# Altium schematic sheet AdcetAlSys.SchDoc
size A0; SheetNumber: 1; SheetTotal: 1
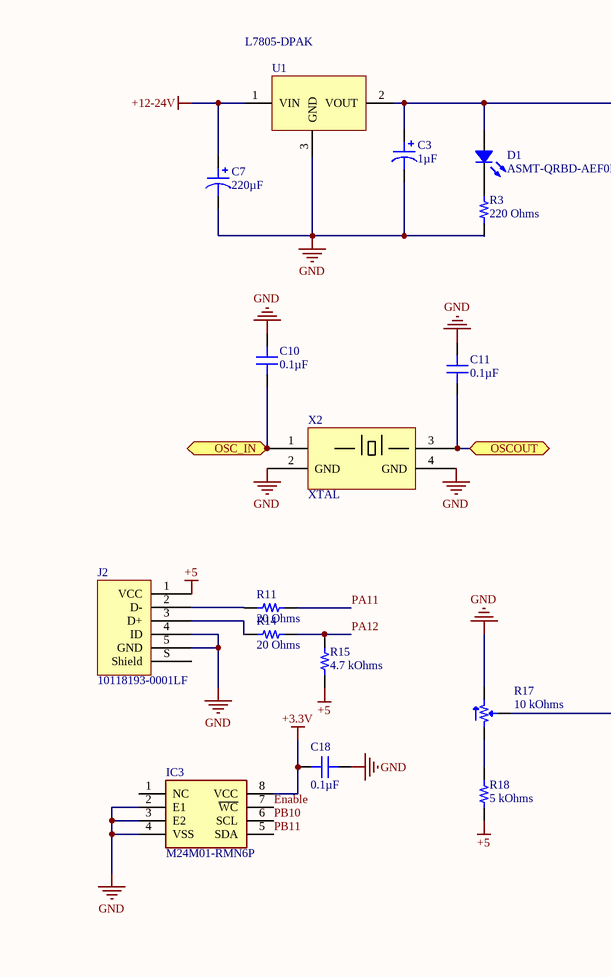
[diagram p0: AdcetAlSys.SchDoc, top left]
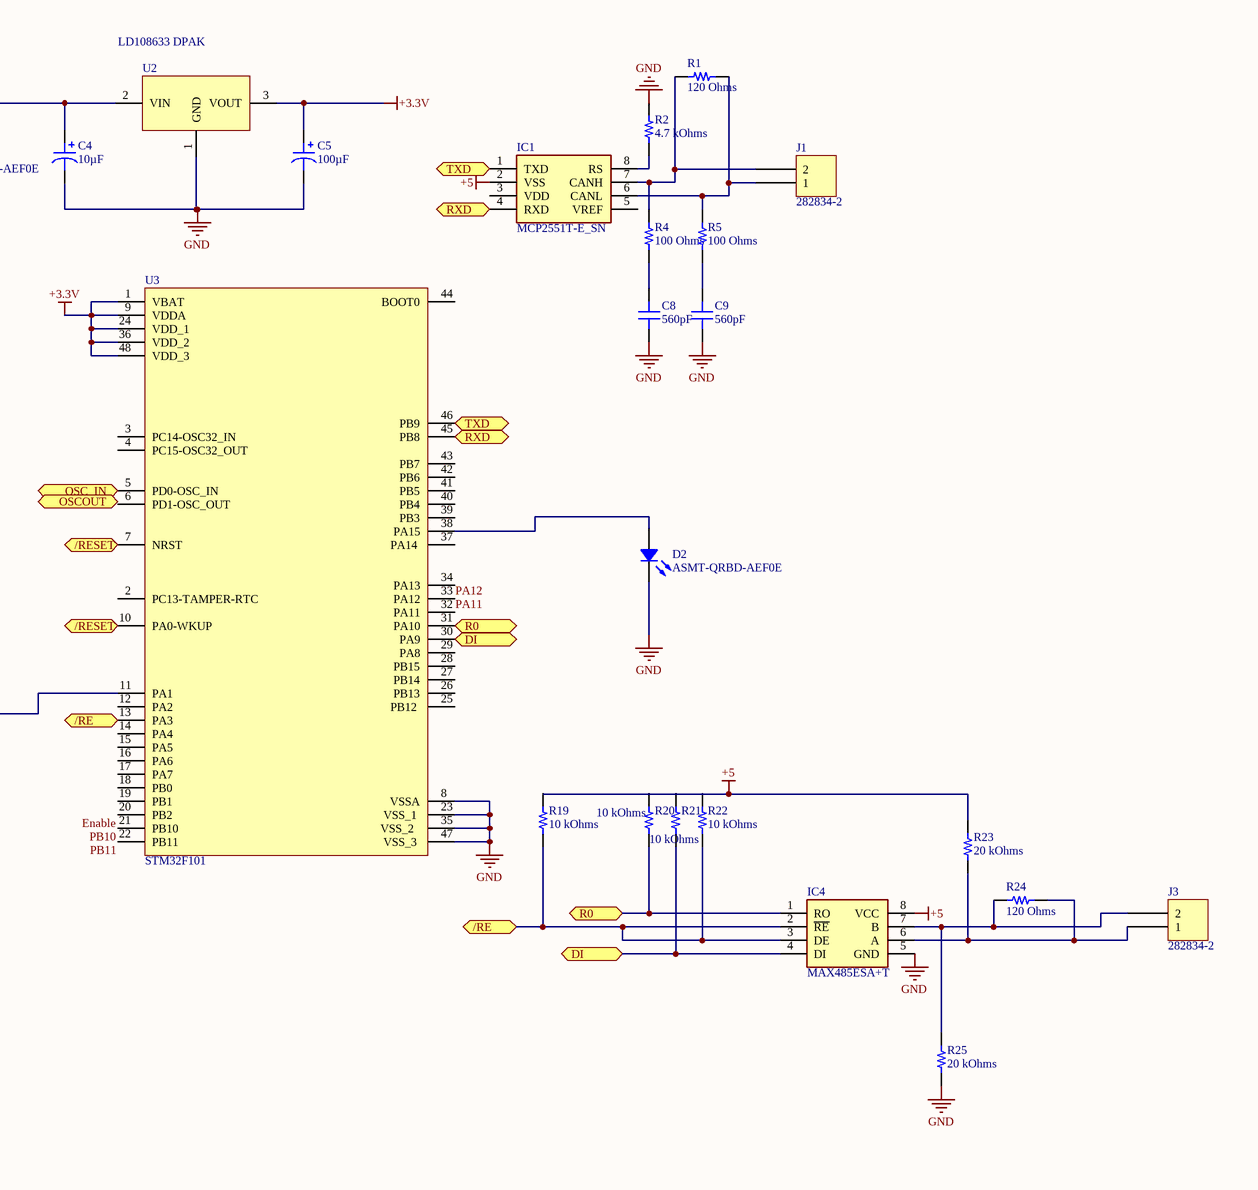
[diagram p1: AdcetAlSys.SchDoc, top right]
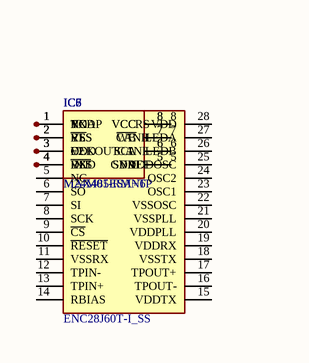
[diagram p2: AdcetAlSys.SchDoc, bottom left]

## Parts
C3  1µF  [CAP TH ALUM ELEC D4.00mm S1.50mm H8.00mm]
C4  10µF  [CAP TH ALUM ELEC D5.00mm S2.00mm H11.00mm]
C5  100µF  [CAP TH ALUM ELEC D6.30mm S2.50mm H11.20mm]
C7  220µF  [CAP TH ALUM ELEC D8.00mm S3.50mm H12.50mm]
C8  560pF  [CAP 0805_2012]
C9  560pF  [CAP 0805_2012]
C10  0.1µF  [CAP 0805_2012]
C11  0.1µF  [CAP 0805_2012]
C18  0.1µF  [CAP 0805_2012]
D1  ASMT-QRBD-AEF0E  [Broadcom 4-PLLC 3228]
D2  ASMT-QRBD-AEF0E  [Broadcom 4-PLLC 3228]
IC1  MCP2551T-E_SN  [SOIC127P600X175-8N]
IC3  M24M01-RMN6P  [SOIC127P600X175-8N]
IC4  MAX485ESA+T  [SOIC127P600X175-8N]
IC5  ENC28J60T-I_SS  [SOP65P780X200-28N]
IC6  MCP2551T-E_SN  [SOIC127P600X175-8N]
IC7  M24M01-RMN6P  [SOIC127P600X175-8N]
IC8  MAX485ESA+T  [SOIC127P600X175-8N]
J1  282834-2  [TE 282834-2]
J2  10118193-0001LF  [FCI USB 10118193-0001LF]
J3  282834-2  [TE 282834-2]
R1  120 Ohms  [RES 0805_2012]
R2  4.7 kOhms  [RES 0805_2012]
R3  220 Ohms  [RES 0805_2012]
R4  100 Ohms  [RES 0805_2012]
R5  100 Ohms  [RES 0805_2012]
R11  20 Ohms  [RES 0603_1608]
R14  20 Ohms  [RES 0603_1608]
R15  4.7 kOhms  [RES 0603_1608]
R17  10 kOhms  [POT BOURNS TRIMPOT TC33]
R18  5 kOhms  [RES 0805_2012]
R19  10 kOhms  [RES 0805_2012]
R20  10 kOhms  [RES 0805_2012]
R21  10 kOhms  [RES 0805_2012]
R22  10 kOhms  [RES 0805_2012]
R23  20 kOhms  [RES 0805_2012]
R24  120 Ohms  [RES 0805_2012]
R25  20 kOhms  [RES 0805_2012]
U1  L7805-DPAK  [DPAK228P972X230-3N]
U2  LD108633 DPAK  [DPAK228P972X230-3N]
U3  STM32F101  [LQFP48-STM]
X2  XTAL  [xtal]

## Ports
/RE (bidir), /RESET (bidir), DI (bidir), OSC_IN (bidir), OSCOUT (bidir), R0 (bidir), RXD (bidir), TXD (bidir)

## Nets
+3.3V: C5.1 C18.1 IC3.8(VCC) U2.3(VOUT) U3.1(VBAT) U3.9(VDDA) U3.24(VDD_1) U3.36(VDD_2) U3.48(VDD_3)
+5: IC1.2(VSS) IC4.8(VCC) J2.1(VCC) R15.1 R18.1 R23.2
+12-24V: C7.1 U1.1(VIN)
GND: C3.2 C4.2 C5.2 C7.2 C8.1 C9.1 C10.1 C11.1 C18.2 D2.2 IC3.2(E1) IC3.3(E2) IC3.4(VSS) IC4.5(GND) J2.4(ID) J2.5(GND) R3.1 R17.3 R25.1 U1.3(GND) U2.1(GND) U3.8(VSSA) U3.23(VSS_1) U3.35(VSS_2) U3.47(VSS_3) X2.2(GND) X2.4(GND)
/RE: IC4.2(~{RE}) IC4.3(DE) R19.1 R22.1 U3.13(PA3) ; port /RE
/RESET: U3.7(NRST) U3.10(PA0-WKUP) ; port /RESET
DI: IC4.4(DI) R21.1 U3.30(PA9) ; port DI
Enable: IC3.7(~{WC}) U3.20(PB2)
OSC_IN: C10.2 U3.5(PD0-OSC_IN) X2.1 ; port OSC_IN
OSCOUT: C11.2 X2.3 ; port OSCOUT
PA11: R11.2 U3.32(PA11)
PA12: R14.2 R15.2 U3.33(PA12)
PB10: IC3.6(SCL) U3.21(PB10)
PB11: IC3.5(SDA) U3.22(PB11)
R0: IC4.1(RO) R20.1 U3.31(PA10) ; port R0
RXD: IC1.4(RXD) U3.45(PB8) ; port RXD
TXD: IC1.1(TXD) U3.46(PB9) ; port TXD
NetC3_1: C3.1 C4.1 D1.1 U1.2(VOUT) U2.2(VIN)
NetC8_2: C8.2 R4.1
NetC9_2: C9.2 R5.1
NetD2_1: D2.1 U3.38(PA15)
NetIC1_6: IC1.6(CANL) J1.1 R1.2 R5.2
NetIC1_7: IC1.7(CANH) J1.2 R1.1 R4.2
NetIC1_8: IC1.8(RS) R2.1
NetIC4_6: IC4.6(A) J3.1 R23.1 R24.2
NetIC4_7: IC4.7(B) J3.2 R24.1 R25.2
NetIC5_1: IC5.1(VCAP) IC6.1(TXD) IC7.1(NC) IC8.1(RO)
NetIC5_2: IC5.2(VSS) IC6.2(VSS) IC7.2(E1) IC8.2(~{RE})
NetIC5_3: IC5.3(CLKOUT) IC6.3(VDD) IC7.3(E2) IC8.3(DE)
NetIC5_4: IC5.4(~{INT}) IC6.4(RXD) IC7.4(VSS) IC8.4(DI)
NetIC7_5: IC7.5(SDA) IC8.5(GND)
NetIC7_6: IC7.6(SCL) IC8.6(A)
NetIC7_7: IC7.7(~{WC}) IC8.7(B)
NetIC7_8: IC7.8(VCC) IC8.8(VCC)
NetJ2_2: J2.2(D-) R11.1
NetJ2_3: J2.3(D+) R14.1
NetR17_1: R17.1 R18.2
NetR17_2: R17.2 U3.11(PA1)

Not connected (* = marked no-connect by the designer): D1 2; IC1 3(VDD) 5(VREF); IC3 1(NC); IC5 5(NC) 6(SO) 7(SI) 8(SCK) 9(~{CS}) 10(~{RESET}) 11(VSSRX) 12(TPIN-) 13(TPIN+) 14(RBIAS) 15(VDDTX) 16(TPOUT-) 17(TPOUT+) 18(VSSTX) 19(VDDRX) 20(VDDPLL) 21(VSSPLL) 22(VSSOSC) 23(OSC1) 24(OSC2) 25(VDDOSC) 26(LEDB) 27(LEDA) 28(VDD); IC6 5(VREF) 6(CANL) 7(CANH) 8(RS); J2 S(Shield); R2 2; R3 2; R19 2; R20 2; R21 2; R22 2; U3 2(PC13-TAMPER-RTC) 3(PC14-OSC32_IN) 4(PC15-OSC32_OUT) 6(PD1-OSC_OUT) 12(PA2) 14(PA4) 15(PA5) 16(PA6) 17(PA7) 18(PB0) 19(PB1) 25(PB12_) 26(PB13) 27(PB14) 28(PB15) 29(PA8) 34(PA13) 37(PA14_) 39(PB3) 40(PB4) 41(PB5) 42(PB6) 43(PB7) 44(BOOT0)

## Notes on the sheet
- Labels drawn without touching a wire or pin: GND

## Library data of the parts
C3 = USR1H010MDD: CAP ALUM 1UF 20% 50V RADIAL; Manufacturer: Nichicon; Lifetime @ Temp.: 2000 Hrs @ 85°C; Polarization: Polar; Ripple Current @ High Frequency: 15mA @ 10kHz; Ripple Current @ Low Frequency: 10mA @ 120Hz; Part Number: USR1H010MDD; Applications: General Purpose; Capacitance: 1µF; ComponentLink1Description: Datasheet; ComponentLink1URL: http://nichicon-us.com/english/products/pdfs/e-usa_usr.pdf; ComponentLink2Description: DigiKey Link; ComponentLink2URL: http://digikey.com/product-detail/en/nichicon/USR1H010MDD/493-6031-ND/2539217; Device Package: Radial, Can; Height - Seated (Max): 0.315" (8.00mm); LastUpdated: 6.09.2020 01:48:38; Lead Spacing: 0.059" (1.50mm); Lifecycle Status: Active; Minimum Order: 1; Mounting Type: Through Hole; Operating Temperature: -40°C ~ 85°C; Package / Case: Radial, Can; Packaging: Bulk; PartId: 23369; Part Status: Active; Price: 0.23; Series: USR; Size / Dimension: 0.157" Dia (4.00mm); Supplier 1: DigiKey; Supplier Part Number 1: 493-6031-ND; Tolerance: ±20%; Value: 1µF; Voltage - Rated: 50V
C4 = RFS-16V100ME3#5: CAP ALUM 10UF 20% 16V RADIAL; Manufacturer: Elna America; Lifetime @ Temp.: 1000 Hrs @ 85°C; Polarization: Polar; Ripple Current @ Low Frequency: 35mA @ 120Hz; Part Number: RFS-16V100ME3#5; Applications: Audio; Capacitance: 10µF; ComponentLink1Description: Datasheet; ComponentLink1URL: http://www.elna.co.jp/en/capacitor/alumi/catalog/pdf/rfs_e.pdf; ComponentLink2Description: DigiKey Link; ComponentLink2URL: http://digikey.com/product-detail/en/elna-america/RFS-16V100ME3-5/604-1109-ND/2171160; Device Package: Radial, Can; Height - Seated (Max): 0.433" (11.00mm); LastUpdated: 4.09.2020 23:28:56; Lead Spacing: 0.079" (2.00mm); Lifecycle Status: Active; Minimum Order: 1; Mounting Type: Through Hole; Operating Temperature: -40°C ~ 85°C; Package / Case: Radial, Can; Packaging: Bulk; PartId: 21468; Part Status: Active; Price: 0.30; Series: RFS, SILMIC II; Size / Dimension: 0.197" Dia (5.00mm); Supplier 1: DigiKey; Supplier Part Number 1: 604-1109-ND; Tolerance: ±20%; Value: 10µF; Voltage - Rated: 16V
C5 = ECE-A0JN101U: CAP ALUM 100UF 20% 6.3V RADIAL; Manufacturer: Panasonic Electronic Components; Lifetime @ Temp.: 2000 Hrs @ 85°C; Polarization: Bi-Polar; Ripple Current @ High Frequency: 221mA @ 10kHz; Part Number: ECE-A0JN101U; Applications: General Purpose; Capacitance: 100µF; ComponentLink2Description: DigiKey Link; ComponentLink2URL: http://digikey.com/product-detail/en/panasonic-electronic-components/ECE-A0JN101U/P1143-ND/227584; Device Package: Radial, Can; Height - Seated (Max): 0.441" (11.20mm); LastUpdated: 4.09.2020 01:05:43; Lead Spacing: 0.098" (2.50mm); Lifecycle Status: Active; Minimum Order: 1; Mounting Type: Through Hole; Operating Temperature: -40°C ~ 85°C; Package / Case: Radial, Can; Packaging: Bulk; PartId: 19981; Part Status: Active; Price: 0.45; Series: SU; Size / Dimension: 0.248" Dia (6.30mm); Supplier 1: DigiKey; Supplier Part Number 1: P1143-ND; Tolerance: ±20%; Value: 100µF; Voltage - Rated: 6.3V
C7 = ECA-1VM221BJ: CAP ALUM 220UF 20% 35V RADIAL; Manufacturer: Panasonic Electronic Components; Lifetime @ Temp.: 2000 Hrs @ 85°C; Polarization: Polar; Ripple Current @ High Frequency: 595mA @ 10kHz; Ripple Current @ Low Frequency: 350mA @ 120Hz; Part Number: ECA-1VM221BJ; Applications: General Purpose; Capacitance: 220µF; ComponentLink1Description: Datasheet; ComponentLink1URL: //media.digikey.com/pdf/Data%20Sheets/Panasonic%20Electronic%20Components/ECA-xxM%20Series,TypeA.pdf; ComponentLink2Description: DigiKey Link; ComponentLink2URL: http://digikey.com/product-detail/en/panasonic-electronic-components/ECA-1VM221BJ/P10419TB-ND/268504; Device Package: Radial, Can; Height - Seated (Max): 0.492" (12.50mm); LastUpdated: 7.09.2020 05:24:51; Lead Spacing: 0.138" (3.50mm); Lifecycle Status: Active; Minimum Order: 1000; Mounting Type: Through Hole; Operating Temperature: -40°C ~ 85°C; Package / Case: Radial, Can; Packaging: TapeAndBox; PartId: 7241; Part Status: Active; Price: 0.08; Series: M; Size / Dimension: 0.315" Dia (8.00mm); Supplier 1: DigiKey; Supplier Part Number 1: P10419TB-ND; Tolerance: ±20%; Value: 220µF; Voltage - Rated: 35V
C8 C9 = 08055A561FAT2A: CAP CER 560PF 50V C0G/NP0 0805; Manufacturer: AVX Corporation; Temperature Coefficient: C0G, NP0; Tolerance: ±1%; Part Number: 08055A561FAT2A; Value: 560pF; Applications: General Purpose; Capacitance: 560pF; ComponentLink1Description: Datasheet; ComponentLink1URL: http://datasheets.avx.com/C0GNP0-Dielectric.pdf; ComponentLink2Description: DigiKey Link; ComponentLink2URL: http://digikey.com/product-detail/en/avx-corporation/08055A561FAT2A/478-6047-1-ND/2208961; Device Package: 0805 (2012 Metric); LastUpdated: 2.09.2020 01:04:40; Lifecycle Status: Active; Minimum Order: 1; Mounting Type: Surface Mount, MLCC; Operating Temperature: -55°C ~ 125°C; Package / Case: 0805 (2012 Metric); Packaging: TapeAndReel; PartId: 3349; Part Status: Active; Price: 0.15; Series: -; Size / Dimension: 0.079" L x 0.049" W (2.01mm x 1.25mm); Supplier 1: DigiKey; Supplier Part Number 1: 478-6047-1-ND; Thickness (Max): 0.037" (0.94mm); Voltage - Rated: 50V
C10 C11 C18 = 0805Y0250104KXT: CAP CER 0.1UF 25V X7R 0805; Manufacturer: Knowles Syfer; Tolerance: ±10%; Part Number: 0805Y0250104KXT; Value: 0.1µF; Applications: Boardflex Sensitive; Capacitance: 0.1µF; ComponentLink1Description: Datasheet; ComponentLink1URL: https://www.knowlescapacitors.com/getattachment/2dbfc8bc-e2b3-4b4d-afb1-43b011b9ebe0/High-Std-Voltage.aspx; ComponentLink2Description: DigiKey Link; ComponentLink2URL: http://digikey.com/product-detail/en/knowles-syfer/0805Y0250104KXT/1608-1010-1-ND/5730209; Device Package: 0805 (2012 Metric); Features: Soft Termination; LastUpdated: 2.09.2020 01:04:40; Lifecycle Status: Active; Minimum Order: 1; Mounting Type: Surface Mount, MLCC; Operating Temperature: -55°C ~ 125°C; Package / Case: 0805 (2012 Metric); Packaging: TapeAndReel; PartId: 3471; Part Status: Active; Price: 0.16; Series: FlexiCap™; Size / Dimension: 0.079" L x 0.049" W (2.00mm x 1.25mm); Supplier 1: DigiKey; Supplier Part Number 1: 1608-1010-1-ND; Temperature Coefficient: X7R; Thickness (Max): 0.051" (1.30mm); Voltage - Rated: 25V
D1 D2 = ASMT-QRBD-AEF0E: LED INDICATOR 0.5W RED 4PLCC; Manufacturer: Broadcom Limited; Current - Max: 300mA; Current - Test: 150mA; Flux @ Current/Temperature - Test: 16lm (12lm ~ 20lm); Lumens/Watt @ Current - Test: 43 lm/W; Temperature - Test: 25°C; Viewing Angle: 120°; Voltage - Forward (Vf) (Typ): 2.5V; Wavelength: 628nm (620nm ~ 635nm); Part Number: ASMT-QRBD-AEF0E; Color: Red; ComponentLink1Description: Datasheet; ComponentLink1URL: https://docs.broadcom.com/docs/AV02-1841EN; ComponentLink2Description: DigiKey Link; ComponentLink2URL: http://digikey.com/product-detail/en/broadcom-limited/ASMT-QRBD-AEF0E/516-2679-1-ND/3909187; Device Package: 4-PLCC; Height - Seated (Max): 0.083" (2.10mm); LastUpdated: 24.04.2020 00:57:49; Lifecycle Status: Active; Minimum Order: 1; Mounting Type: Surface Mount; Package / Case: 4-PLCC; Packaging: TapeAndReel; Part Status: Active; Price: 0.42; Size / Dimension: 0.126" L x 0.110" W (3.20mm x 2.80mm); Supplier 1: DigiKey; Supplier Part Number 1: 516-2679-1-ND; Supplier Device Package: 4-PLCC
IC1 IC6 = MCP2551T-E_SN: Integrated Circuit; Manufacturer_Name: Microchip; Manufacturer_Part_Number: MCP2551T-E/SN; Datasheet Link: https://componentsearchengine.com/Datasheets/1/MCP2551T-E_SN.pdf; Height: 1.75mm; Mouser Part Number: 579-MCP2551T-E/SN; Mouser Price/Stock: https://www.mouser.co.uk/ProductDetail/Microchip-Technology/MCP2551T-E-SN?qs=gZwDaUDMhIcQtLtB%252B7bOWQ%3D%3D; Arrow Part Number: MCP2551T-E/SN; Arrow Price/Stock: https://www.arrow.com/en/products/mcp2551t-esn/microchip-technology?region=nac
IC3 IC7 = M24M01-RMN6P: Integrated Circuit; Manufacturer_Name: STMicroelectronics; Datasheet Link: https://datasheet.datasheetarchive.com/originals/distributors/SFDatasheet-5/sf-000111818.pdf; Height: 1.75mm; Manufacturer_Part_Number: M24M01-RMN6P; Mouser Part Number: 511-M24M01-RMN6P; Mouser Price/Stock: https://www.mouser.co.uk/ProductDetail/STMicroelectronics/M24M01-RMN6P?qs=Djavi1aLnwpufYbzjHXCEA%3D%3D; Arrow Part Number: M24M01-RMN6P; Arrow Price/Stock: https://www.arrow.com/en/products/m24m01-rmn6p/stmicroelectronics?region=nac
IC4 IC8 = MAX485ESA+T: Integrated Circuit; Manufacturer_Name: Maxim Integrated; Datasheet Link: https://datasheets.maximintegrated.com/en/ds/MAX1487-MAX491.pdf; Height: 1.75mm; Manufacturer_Part_Number: MAX485ESA+T; Mouser Part Number: 700-MAX485ESAT; Mouser Price/Stock: https://www.mouser.co.uk/ProductDetail/Maxim-Integrated/MAX485ESA%2bT?qs=LHmEVA8xxfYXmvxEk%252BFtEg%3D%3D; Arrow Part Number: MAX485ESA+T; Arrow Price/Stock: https://www.arrow.com/en/products/max485esat/maxim-integrated?region=nac
IC5 = ENC28J60T-I_SS: Integrated Circuit; Manufacturer_Name: Microchip; Manufacturer_Part_Number: ENC28J60T-I/SS; Datasheet Link: https://mouser.componentsearchengine.com/Datasheets/2/ENC28J60T-I_SS.pdf; Height: 2mm; Mouser Part Number: 579-ENC28J60T-I/SS; Mouser Price/Stock: https://www.mouser.co.uk/ProductDetail/Microchip-Technology/ENC28J60T-I-SS?qs=0swJU7D5CoWRYqX2omYpJQ%3D%3D; Arrow Part Number: ENC28J60T-I/SS; Arrow Price/Stock: https://www.arrow.com/en/products/enc28j60t-iss/microchip-technology?region=nac
J1 J3 = 282834-2: TERM BLK 2P SIDE ENT 2.54MM PCB; Manufacturer: TE Connectivity AMP Connectors; Current: 10A; Mating Orientation: Horizontal with Board; Number of Levels: 1; Pitch: 0.100" (2.54mm); Positions Per Level: 2; Voltage: 150V; Wire Gauge: 16-30 AWG; Wire Termination: Screw - Rising Cage Clamp; Part Number: 282834-2; Color: Green; ComponentLink1Description: Datasheet; ComponentLink1URL: https://www.te.com/commerce/DocumentDelivery/DDEController?Action=srchrtrv&DocNm=282834&DocType=Customer+Drawing&DocLang=English; ComponentLink2Description: DigiKey Link; ComponentLink2URL: http://digikey.com/product-detail/en/te-connectivity-amp-connectors/282834-2/A98333-ND/1150135; LastUpdated: 15.01.2020 04:15:38; Lifecycle Status: Active; Minimum Order: 1; Mounting Type: Through Hole; Packaging: Bulk; Part Status: Active; Price: 0.88; Series: Buchanan; Supplier 1: DigiKey; Supplier Part Number 1: A98333-ND
J2 = 10118193-0001LF: CONN RCPT USB2.0 MICRO B SMD R/A; Manufacturer: Amphenol ICC (FCI); Connector Type: USB - micro B; Current Rating (Amps): 1.8A per Contact; Gender: Receptacle; Mating Cycles: 10000; Number of Contacts: 5; Number of Ports: 1; Shielding: Shielded; Voltage - Rated: 100VAC; Part Number: 10118193-0001LF; ComponentLink1Description: Datasheet; ComponentLink1URL: https://cdn.amphenol-icc.com/media/wysiwyg/files/documentation/datasheet/inputoutput/io_usb_micro.pdf; ComponentLink2Description: DigiKey Link; ComponentLink2URL: //digikey.com/product-detail/en/amphenol-icc-fci/10118193-0001LF/609-4616-2-ND/2785388; Features: Solder Retention; LastUpdated: 9.12.2019 20:51:28; Lifecycle Status: 0; Minimum Order: 1; Mounting Feature: Horizontal; Mounting Type: Surface Mount, Right Angle; Through Hole; Operating Temperature: -30°C ~ 80°C; Packaging: TapeAndReel; Part Status: Active; Price: 0.21; Series: -; Specifications: USB 2.0; Supplier 1: DigiKey; Supplier Part Number 1: 609-4616-2-ND; Termination: Solder
R1 R24 = CRGP0805F120R: CRGP 0805 120R 1%; Manufacturer: TE Connectivity Passive Product; Power (Watts): 0.333W, 1/3W; Temperature Coefficient: ±100ppm/°C; Part Number: CRGP0805F120R; Value: 120 Ohms; ComponentLink1Description: Datasheet; ComponentLink1URL: https://www.te.com/commerce/DocumentDelivery/DDEController?Action=srchrtrv&DocNm=9-1773463-9&DocType=DS&DocLang=English; ComponentLink2Description: DigiKey Link; ComponentLink2URL: http://digikey.com/product-detail/en/te-connectivity-passive-product/CRGP0805F120R/A130466CT-ND/8578298; Composition: Thick Film; Device Package: 0805 (2012 Metric); Features: Pulse Withstanding; Height - Seated (Max): 0.026" (0.65mm); LastUpdated: 2.09.2020 01:14:53; Lifecycle Status: Active; Minimum Order: 1; Number of Terminations: 2; Operating Temperature: -55°C ~ 155°C; Package / Case: 0805 (2012 Metric); Packaging: TapeAndReel; PartId: 41696; Part Status: Active; Price: 0.02; Resistance: 120 Ohms; Series: CRGP; Size / Dimension: 0.079" L x 0.049" W (2.00mm x 1.25mm); Supplier 1: DigiKey; Supplier Part Number 1: A130466CT-ND; Supplier Device Package: 0805; Tolerance: ±1%
R2 = RR1220P-472-D: RES SMD 4.7K OHM 0.5% 1/10W 0805; Manufacturer: Susumu; Power (Watts): 0.1W, 1/10W; Temperature Coefficient: ±25ppm/°C; Part Number: RR1220P-472-D; Value: 4.7 kOhms; ComponentLink1Description: Datasheet; ComponentLink1URL: http://www.susumu.co.jp/common/pdf/n_catalog_partition05_en.pdf; ComponentLink2Description: DigiKey Link; ComponentLink2URL: http://digikey.com/product-detail/en/susumu/RR1220P-472-D/RR12P4.7KDCT-ND/432846; Composition: Thin Film; Device Package: 0805 (2012 Metric); Height - Seated (Max): 0.020" (0.50mm); LastUpdated: 2.09.2020 01:14:59; Lifecycle Status: Active; Minimum Order: 1; Number of Terminations: 2; Operating Temperature: -55°C ~ 125°C; Package / Case: 0805 (2012 Metric); Packaging: TapeAndReel; PartId: 39098; Part Status: Active; Price: 0.01; Resistance: 4.7 kOhms; Series: RR; Size / Dimension: 0.079" L x 0.049" W (2.00mm x 1.25mm); Supplier 1: DigiKey; Supplier Part Number 1: RR12P4.7KDCT-ND; Tolerance: ±0.5%
R3 = ERJ-6ENF2200V: RES SMD 220 OHM 1% 1/8W 0805; Manufacturer: Panasonic Electronic Components; Power (Watts): 0.125W, 1/8W; Temperature Coefficient: ±100ppm/°C; Part Number: ERJ-6ENF2200V; Value: 220 Ohms; ComponentLink1Description: Datasheet; ComponentLink1URL: https://industrial.panasonic.com/cdbs/www-data/pdf/RDA0000/AOA0000C304.pdf; ComponentLink2Description: DigiKey Link; ComponentLink2URL: http://digikey.com/product-detail/en/panasonic-electronic-components/ERJ-6ENF2200V/P220CCT-ND/1746831; Composition: Thick Film; Device Package: 0805 (2012 Metric); Features: Automotive AEC-Q200; Height - Seated (Max): 0.028" (0.70mm); LastUpdated: 2.09.2020 01:15:19; Lifecycle Status: Active; Minimum Order: 1; Number of Terminations: 2; Operating Temperature: -55°C ~ 155°C; Package / Case: 0805 (2012 Metric); Packaging: TapeAndReel; PartId: 30101; Part Status: Active; Price: 0.01; Ratings: AEC-Q200; Resistance: 220 Ohms; Series: ERJ; Size / Dimension: 0.079" L x 0.049" W (2.00mm x 1.25mm); Supplier 1: DigiKey; Supplier Part Number 1: P220CCT-ND; Supplier Device Package: 0805; Tolerance: ±1%
R4 R5 = RR1220P-101-D: RES SMD 100 OHM 0.5% 1/10W 0805; Manufacturer: Susumu; Power (Watts): 0.1W, 1/10W; Temperature Coefficient: ±25ppm/°C; Part Number: RR1220P-101-D; Value: 100 Ohms; ComponentLink1Description: Datasheet; ComponentLink1URL: http://www.susumu.co.jp/common/pdf/n_catalog_partition05_en.pdf; ComponentLink2Description: DigiKey Link; ComponentLink2URL: http://digikey.com/product-detail/en/susumu/RR1220P-101-D/RR12P100DCT-ND/432806; Composition: Thin Film; Device Package: 0805 (2012 Metric); Height - Seated (Max): 0.020" (0.50mm); LastUpdated: 2.09.2020 01:14:59; Lifecycle Status: Active; Minimum Order: 1; Number of Terminations: 2; Operating Temperature: -55°C ~ 125°C; Package / Case: 0805 (2012 Metric); Packaging: TapeAndReel; PartId: 39083; Part Status: Active; Price: 0.01; Resistance: 100 Ohms; Series: RR; Size / Dimension: 0.079" L x 0.049" W (2.00mm x 1.25mm); Supplier 1: DigiKey; Supplier Part Number 1: RR12P100DCT-ND; Tolerance: ±0.5%
R11 R14 = ERJ-PA3J200V: RES SMD 20 OHM 5% 1/4W 0603; Manufacturer: Panasonic Electronic Components; Power (Watts): 0.25W, 1/4W; Temperature Coefficient: ±200ppm/°C; Part Number: ERJ-PA3J200V; Value: 20 Ohms; ComponentLink1Description: Datasheet; ComponentLink1URL: https://industrial.panasonic.com/cdbs/www-data/pdf/RDO0000/AOA0000C331.pdf; ComponentLink2Description: DigiKey Link; ComponentLink2URL: http://digikey.com/product-detail/en/panasonic-electronic-components/ERJ-PA3J200V/P20.00BZCT-ND/5036277; Composition: Thick Film; Device Package: 0603 (1608 Metric); Features: Automotive AEC-Q200, Pulse Withstanding; Height - Seated (Max): 0.022" (0.55mm); LastUpdated: 2.09.2020 01:09:51; Lifecycle Status: Active; Minimum Order: 1; Number of Terminations: 2; Operating Temperature: -55°C ~ 155°C; Package / Case: 0603 (1608 Metric); Packaging: TapeAndReel; PartId: 20433; Part Status: Active; Price: 0.01; Ratings: AEC-Q200; Resistance: 20 Ohms; Series: ERJ; Size / Dimension: 0.063" L x 0.031" W (1.60mm x 0.80mm); Supplier 1: DigiKey; Supplier Part Number 1: P20.00BZCT-ND; Supplier Device Package: 0603; Tolerance: ±5%
R15 = CRG0603F4K7: RES SMD 4.7K OHM 1% 1/10W 0603; Manufacturer: TE Connectivity Passive Product; Power (Watts): 0.1W, 1/10W; Temperature Coefficient: ±100ppm/°C; Part Number: CRG0603F4K7; Value: 4.7 kOhms; ComponentLink1Description: Datasheet; ComponentLink1URL: https://www.te.com/commerce/DocumentDelivery/DDEController?Action=srchrtrv&DocNm=1773204&DocType=DS&DocLang=English; ComponentLink2Description: DigiKey Link; ComponentLink2URL: http://digikey.com/product-detail/en/te-connectivity-passive-product/CRG0603F4K7/A106050CT-ND/3477690; Composition: Thick Film; Device Package: 0603 (1608 Metric); Height - Seated (Max): 0.022" (0.55mm); LastUpdated: 2.09.2020 01:09:39; Lifecycle Status: Active; Minimum Order: 1; Number of Terminations: 2; Operating Temperature: -55°C ~ 155°C; Package / Case: 0603 (1608 Metric); Packaging: CutTape; PartId: 24011; Part Status: Active; Price: 0.10; Resistance: 4.7 kOhms; Series: CRG, Neohm; Size / Dimension: 0.063" L x 0.031" W (1.60mm x 0.80mm); Supplier 1: DigiKey; Supplier Part Number 1: A106050CT-ND; Supplier Device Package: 0603; Tolerance: ±1%
R17 = TC33X-2-103G: TRIMMER 10K OHM 0.1W J LEAD TOP; Manufacturer: Bourns Inc.; Adjustment Type: Top Adjustment; Number of Turns: 1; Power (Watts): 0.1W, 1/10W; Resistive Material: Cermet; Temperature Coefficient: ±250ppm/°C; Tolerance: ±25%; Part Number: TC33X-2-103G; ComponentLink1Description: Datasheet; ComponentLink1URL: https://www.bourns.com/docs/Product-Datasheets/TC33.pdf; ComponentLink2Description: DigiKey Link; ComponentLink2URL: http://digikey.com/product-detail/en/bourns-inc/TC33X-2-103G/TC33X-2-103G-ND/2566880; LastUpdated: 30.08.2020 21:01:57; Lifecycle Status: Active; Minimum Order: 9000; Mounting Type: Surface Mount; Packaging: TapeAndReel; PartId: 68; Price: 0.13; Resistance: 10 kOhms; Series: Trimpot® TC33 - Open Frame; Size / Dimension: Rectangular - 0.150" x 0.142" Face x 0.047" H (3.80mm x 3.60mm x 1.20mm); Supplier 1: DigiKey; Supplier Part Number 1: TC33X-2-103G-ND; Termination Style: J Lead; Value: 10 kOhms
R18 = CRCW08055K00FKTA: RES SMD 5K OHM 1% 1/8W 0805; Manufacturer: Vishay Dale; Power (Watts): 0.125W, 1/8W; Temperature Coefficient: ±100ppm/°C; Part Number: CRCW08055K00FKTA; Value: 5 kOhms; ComponentLink1Description: Datasheet; ComponentLink1URL: http://www.vishay.com/docs/20008/dcrcw.pdf; ComponentLink2Description: DigiKey Link; ComponentLink2URL: http://digikey.com/product-detail/en/vishay-dale/CRCW08055K00FKTA/541-4321-1-ND/8565934; Composition: Thick Film; Device Package: 0805 (2012 Metric); Features: Automotive AEC-Q200; Height - Seated (Max): 0.020" (0.50mm); LastUpdated: 2.09.2020 01:14:31; Lifecycle Status: Active; Minimum Order: 1; Number of Terminations: 2; Operating Temperature: -55°C ~ 155°C; Package / Case: 0805 (2012 Metric); Packaging: TapeAndReel; PartId: 48587; Part Status: Active; Price: 0.02; Ratings: AEC-Q200; Resistance: 5 kOhms; Series: CRCW; Size / Dimension: 0.079" L x 0.049" W (2.00mm x 1.25mm); Supplier 1: DigiKey; Supplier Part Number 1: 541-4321-1-ND; Supplier Device Package: 0805; Tolerance: ±1%
R19-R22 = CRCW080510K0FKEA: RES SMD 10K OHM 1% 1/8W 0805; Manufacturer: Vishay Dale; Power (Watts): 0.125W, 1/8W; Temperature Coefficient: ±100ppm/°C; Part Number: CRCW080510K0FKEA; Value: 10 kOhms; ComponentLink1Description: Datasheet; ComponentLink1URL: http://www.vishay.com/docs/20035/dcrcwe3.pdf; ComponentLink2Description: DigiKey Link; ComponentLink2URL: http://digikey.com/product-detail/en/vishay-dale/CRCW080510K0FKEA/541-10.0KCCT-ND/1180897; Composition: Thick Film; Device Package: 0805 (2012 Metric); Features: Automotive AEC-Q200; Height - Seated (Max): 0.020" (0.50mm); LastUpdated: 2.09.2020 01:15:23; Lifecycle Status: Active; Minimum Order: 1; Number of Terminations: 2; Operating Temperature: -55°C ~ 155°C; Package / Case: 0805 (2012 Metric); Packaging: TapeAndReel; PartId: 28101; Part Status: Active; Price: 0.01; Ratings: AEC-Q200; Resistance: 10 kOhms; Series: CRCW; Size / Dimension: 0.079" L x 0.049" W (2.00mm x 1.25mm); Supplier 1: DigiKey; Supplier Part Number 1: 541-10.0KCCT-ND; Supplier Device Package: 0805; Tolerance: ±1%
R23 R25 = RR1220P-203-D: RES SMD 20K OHM 0.5% 1/10W 0805; Manufacturer: Susumu; Power (Watts): 0.1W, 1/10W; Temperature Coefficient: ±25ppm/°C; Part Number: RR1220P-203-D; Value: 20 kOhms; ComponentLink1Description: Datasheet; ComponentLink1URL: http://www.susumu.co.jp/common/pdf/n_catalog_partition05_en.pdf; ComponentLink2Description: DigiKey Link; ComponentLink2URL: http://digikey.com/product-detail/en/susumu/RR1220P-203-D/RR12P20.0KDCT-ND/432861; Composition: Thin Film; Device Package: 0805 (2012 Metric); Height - Seated (Max): 0.020" (0.50mm); LastUpdated: 2.09.2020 01:14:59; Lifecycle Status: Active; Minimum Order: 1; Number of Terminations: 2; Operating Temperature: -55°C ~ 125°C; Package / Case: 0805 (2012 Metric); Packaging: TapeAndReel; PartId: 39126; Part Status: Active; Price: 0.01; Resistance: 20 kOhms; Series: RR; Size / Dimension: 0.079" L x 0.049" W (2.00mm x 1.25mm); Supplier 1: DigiKey; Supplier Part Number 1: RR12P20.0KDCT-ND; Tolerance: ±0.5%
U1 = L7805-DPAK: L7805 5V REGULATOR. SMD PAKET
U2 = LD108633 DPAK: LD1086 3.3V REGULATOR
U3 = STM32F101: STM32F101 48 PİNLİ MİKROİŞLEMCİ
X2 = XTAL: 16MHz Xtal